# Altium schematic sheet Analog Input Connector.SchDoc
size 297 x 209 mm; CompanyName: Sainsbury Wellcome Centre; Organization: FabLab; Address1: Sainsbury Wellcome Centre; Address2: 25 Howland Street; Address3: London; Address4: W1T 4JG; DocumentNumber: 6; SheetNumber: 6; SheetTotal: 12; swcgroup: FabLab; Org: Sainsbury Wellcome Centre; Add1: 25 Howland Street; Add2: London; Add3: W1T 4JG; WebAddress: www.sainsburywellcome.org; SheetSize: A4; SheetName: Analog Input A
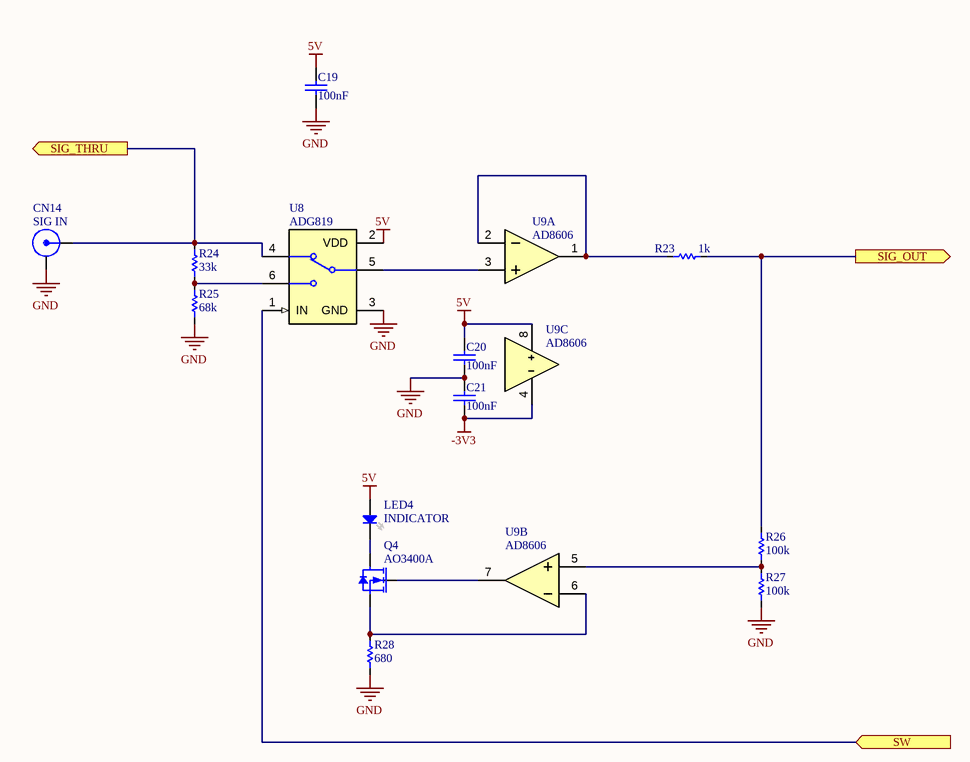
[diagram p0: Analog Input Connector.SchDoc]

## Parts
C19  value 100nF  [CAP_CHIP_0603]  (hidden comment: C0603-100nF-50V)
C20  value 100nF  [CAP_CHIP_0603]  (hidden comment: C0603-100nF-50V)
C21  value 100nF  [CAP_CHIP_0603]  (hidden comment: C0603-100nF-50V)
CN14  SIG IN  [BNC-AMP-112515]
LED4  INDICATOR  [LED_CHIP_0805]
Q4  AO3400A  [SOT23]
R23  value 1k  [RES_CHIP_0603]  (hidden comment: R0603-1K)
R24  value 33k  [RES_CHIP_0603]  (hidden comment: R0603-33K)
R25  value 68k  [RES_CHIP_0603]  (hidden comment: R0603-68K)
R26  value 100k  [RES_CHIP_0603]  (hidden comment: R0603-100K)
R27  value 100k  [RES_CHIP_0603]  (hidden comment: R0603-100K)
R28  value 680  [RES_CHIP_0603]  (hidden comment: R0603-680R)
U8  ADG819  [SOT23-6]
U9  AD8606  [VSSOP8_3X3_0.65E]  (parts A,B,C of 3)

## Ports
SIG_OUT (out), SIG_THRU (out), SW (in)

## Nets
5V: C19.2 C20.2 LED4.2(A) U8.2(VDD) U9.8(V+)
-3V3: C21.1 U9.4(V-)
GND: C19.1 C20.1 C21.2 CN14.2(GND) R25.1 R27.1 R28.1 U8.3(GND)
SIG_OUT: R23.2 R26.2 ; port SIG_OUT
SIG_THRU: CN14.1(SIG) R24.2 U8.4(S1) ; port SIG_THRU
SW: U8.1(IN) ; port SW
NetLED4_1: LED4.1(K) Q4.3(D)
NetQ4_1: Q4.1(G) U9.7(BOUT)
NetQ4_2: Q4.2(S) R28.2 U9.6(B-)
NetR23_1: R23.1 U9.1(AOUT) U9.2(A-)
NetR24_1: R24.1 R25.2 U8.6(S2)
NetR26_1: R26.1 R27.2 U9.5(B+)
NetU8_5: U8.5(D) U9.3(A+)

## Notes on the sheet
- FILE
- VARIANT
- DATE
- REVISION
- SHEET
- /
- PROJECT
- SIZE

## Library data of the parts
C19-C21 = CMP-611-0027-24: 0603 Multilayer Ceramic Capacitors MLCC; PartNumber: CC0603KRX7R9BB104; Tolerance: 10%; Pick&PlaceFootprint: C0603; Dielectric: X7R; Voltage Rating: 50V; Capacitor Type: Ceramic; RoHS: Yes; Mount: SMD; LCSC Part N.: C14663; Case/Package: 0603
CN14 = CMP-730-0003-11: RF BNC Connector, Female, Board Mount, Solder Terminal, Jack; PartNumber: 112515; Clock Frequency: 4GHz; Characteristic Impedance: 50R; LCSC Part N.: C3176191; Orientation: Straight; Connector Type: BNC; Gender: Female
LED4 = CMP-520-0018-2: White 0805 Light Emitting Diodes (LED) ROHS; PartNumber: KT-0805W; Forward Current: 25mA; Wavelength: 405nm; Pick&PlaceFootprint: LED0805; Forward Voltage: 2.9V; Colour: White; LCSC Part N.: C34499; Mount: Surface Mount
Q4 = CMP-810-0002-2: 30V 5.7A 26.5mΩ@10V,5.7A 1.4W 1.5V@250uA 1 NChannel SOT-23-3L MOSFETs; Gate-Source Voltage (Vgs): 12V; Pick&PlaceFootprint: SOT-23; RDS(ON): 26.5mR; Switching Time: 34.5ns; LCSC Part N.: C20917; Drain-Source Voltage (Vds): 30V; Mount: Surface Mount; PartNumber: AO3400A; Power Dissipation: 1.4W; Drain Current (Id): 5.7A; Polarity: N Channel
R23 = CMP-633-0013-26: 100mW Thick Film Resistors 75V ±100ppm/℃ ±1% 0603 Chip Resistor; PartNumber: 0603WAF1001T5E; Pick&PlaceFootprint: R0603; Number of Resistors: 1; Voltage Rating: 75V; Case/Package: 0603; Tolerance: 1%; Mount: Surface Mount; LCSC Part N.: C21190; Power Rating: 100mW
R24 = CMP-633-0105-10: 100mW Thick Film Resistors 75V ±100ppm/℃ ±1% 0603 Chip Resistor; PartNumber: 0603WAF3302T5E; Pick&PlaceFootprint: R0603; Number of Resistors: 1; Tolerance: 1%; Mount: Surface Mount; Voltage Rating: 75V; LCSC Part N.: C4216; Case/Package: 0603; Power Rating: 100mW
R25 = CMP-633-0107-3: 100mW Thick Film Resistors 75V ±100ppm/℃ ±1% 0603 Chip Resistor; PartNumber: 0603WAF6802T5E; Pick&PlaceFootprint: R0603; Number of Resistors: 1; Tolerance: 1%; LCSC Part N.: C23231; Case/Package: 0603; Power Rating: 100mW; Mount: Surface Mount; Voltage Rating: 75V
R26 R27 = CMP-633-0000-28: 100mW Thick Film Resistors 75V ±100ppm/℃ ±1% 0603 Chip Resistor; PartNumber: 0603WAF1003T5E; Number of Resistors: 1; Pick&PlaceFootprint: R0603; LCSC Part N.: C25803; Mount: Surface Mount; Voltage Rating: 75V; Power Rating: 100mW; Case/Package: 0603; Tolerance: 1%
R28 = CMP-633-0087-12: 100mW Thick Film Resistors 75V ±100ppm/℃ ±1% 0603 Chip Resistor; PartNumber: 0603WAF6800T5E; Number of Resistors: 1; Pick&PlaceFootprint: R0603; Voltage Rating: 75V; Case/Package: 0603; Power Rating: 100mW; Tolerance: 1%; Mount: Surface Mount; LCSC Part N.: C23228
U8 = CMP-9A0-0003-1: Analog Switch/Analog Multiplexer Single 2: 1 Automotive 6-Pin SOT-23 T/R; PartNumber: ADG819BRTZ-REEL7; Throw Configuration: SPDT; On-State Resistance: 600mR; Number of Channels: 1; Max Supply Voltage: 5.5V; Min Supply Voltage: 1.8V; Bandwidth: 17MHz; LCSC Part N.: C579118
U9 = CMP-941-0002-4: Operational Amplifier, 2 Func, 750uV Offset-Max, CMOS, PDSO8; PartNumber: AD8606ARMZ-REEL; Pick&PlaceFootprint: MSOP-8; Slew Rate: 5V/µs; Min Supply Voltage: 0V; Input Offset Voltage: 65µV; CMRR: 100dB; Max Supply Voltage: 5V; Voltage Drift: 4.5µV/°C; PSRR: 95dB; Quiescent Current: 1mA; Max Supply Current: 80mA; Gain Bandwidth: 10MHz; LCSC Part N.: C459905